# Altium schematic sheet USB_Hub.SchDoc: USB Hub
size 431 x 279 mm; Author: Eric Liu; SheetNumber: 6; SheetTotal: 6
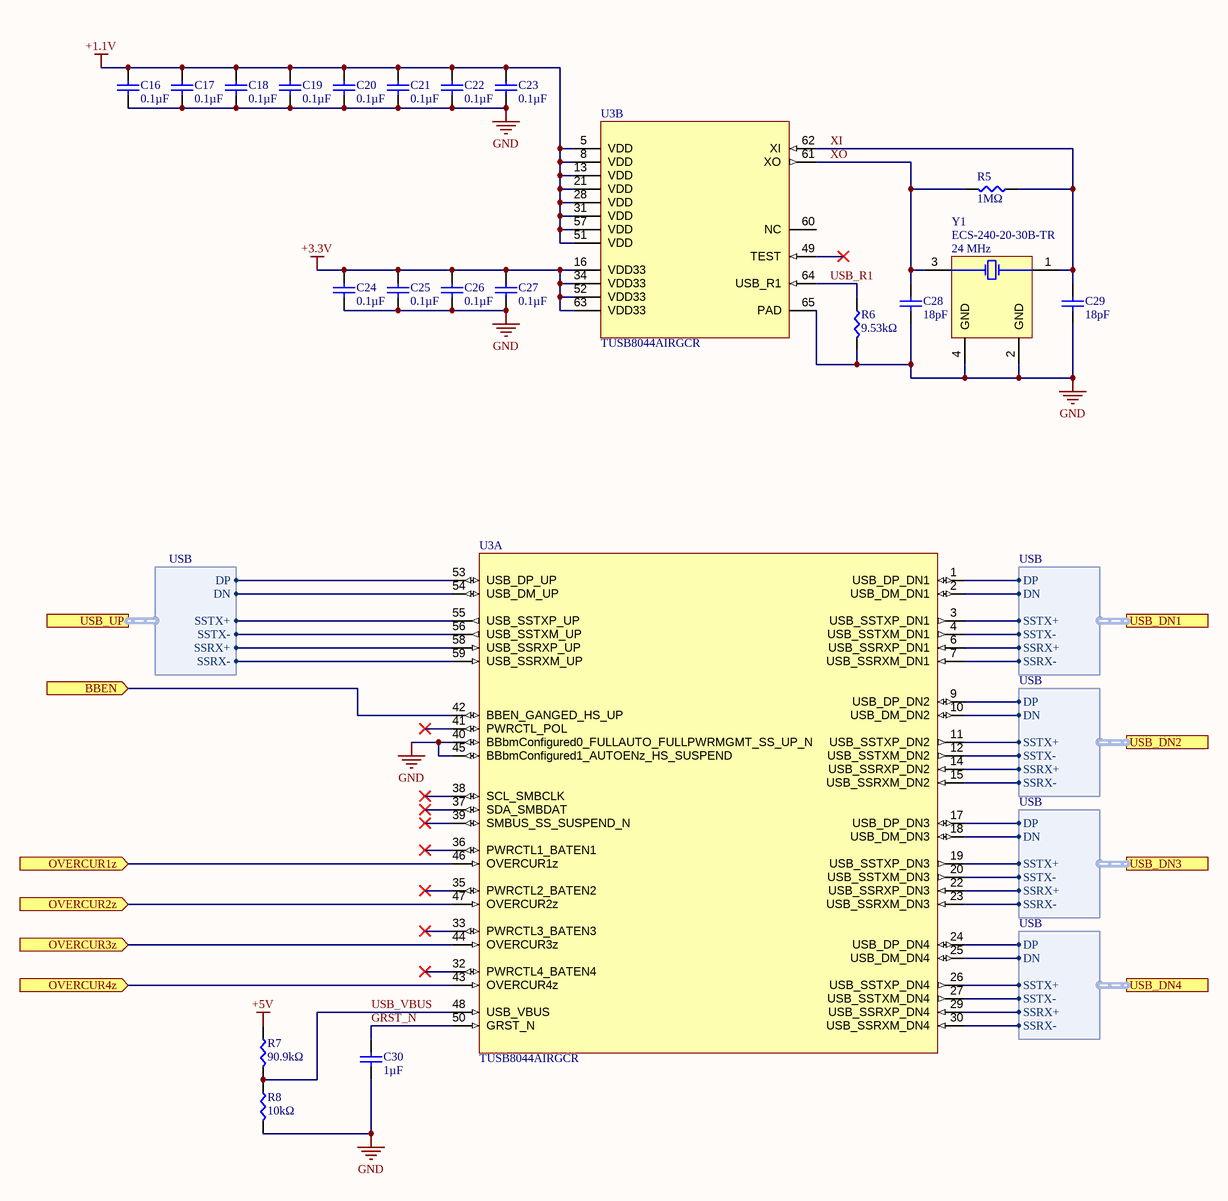
[diagram p0: USB_Hub.SchDoc]

## Parts
C16  value 0.1µF  [CAP0402]  (hidden comment: CC0402KRX5R9BB104)
C17  value 0.1µF  [CAP0402]  (hidden comment: CC0402KRX5R9BB104)
C18  value 0.1µF  [CAP0402]  (hidden comment: CC0402KRX5R9BB104)
C19  value 0.1µF  [CAP0402]  (hidden comment: CC0402KRX5R9BB104)
C20  value 0.1µF  [CAP0402]  (hidden comment: CC0402KRX5R9BB104)
C21  value 0.1µF  [CAP0402]  (hidden comment: CC0402KRX5R9BB104)
C22  value 0.1µF  [CAP0402]  (hidden comment: CC0402KRX5R9BB104)
C23  value 0.1µF  [CAP0402]  (hidden comment: CC0402KRX5R9BB104)
C24  value 0.1µF  [CAP0402]  (hidden comment: CC0402KRX5R9BB104)
C25  value 0.1µF  [CAP0402]  (hidden comment: CC0402KRX5R9BB104)
C26  value 0.1µF  [CAP0402]  (hidden comment: CC0402KRX5R9BB104)
C27  value 0.1µF  [CAP0402]  (hidden comment: CC0402KRX5R9BB104)
C28  value 18pF  [CAP0402]  (hidden comment: GJM1555C1H180FB01D)
C29  value 18pF  [CAP0402]  (hidden comment: GJM1555C1H180FB01D)
C30  value 1µF  [CAP0402]  (hidden comment: GRM155R61H105KE05D)
R5  value 1MΩ  [RES0402]  (hidden comment: RC0402FR-071ML)
R6  value 9.53kΩ  [RES0402]  (hidden comment: CRCW04029K53FKED)
R7  value 90.9kΩ  [RES0402]  (hidden comment: RC0402FR-0790K9L)
R8  value 10kΩ  [RES0402]  (hidden comment: RC0402FR-0710KL)
U3  TUSB8044AIRGCR  [RGC0064G]  (parts A,B of 2)
Y1  ECS-240-20-30B-TR  value 24 MHz  [ECS-240-20-30B-TR]

## Ports
BBEN (in), OVERCUR1z (in), OVERCUR2z (in), OVERCUR3z (in), OVERCUR4z (in), USB_DN1 (harness USB), USB_DN2 (harness USB), USB_DN3 (harness USB), USB_DN4 (harness USB), USB_UP (harness USB)

## Harnesses
USB: DP, DN, SSRX+, SSRX-, SSTX+, SSTX-

## Nets
+1.1V: C16.2 C17.2 C18.2 C19.2 C20.2 C21.2 C22.2 C23.2 U3.5(VDD) U3.8(VDD) U3.13(VDD) U3.21(VDD) U3.28(VDD) U3.31(VDD) U3.51(VDD) U3.57(VDD)
+3.3V: C24.2 C25.2 C26.2 C27.2 U3.16(VDD33) U3.34(VDD33) U3.52(VDD33) U3.63(VDD33)
+5V: R7.2
GND: C16.1 C17.1 C18.1 C19.1 C20.1 C21.1 C22.1 C23.1 C24.1 C25.1 C26.1 C27.1 C28.1 C29.1 C30.1 R6.1 R8.1 U3.40(BBbmConfigured0_FULLAUTO_FULLPWRMGMT_SS_UP_N) U3.45(BBbmConfigured1_AUTOENz_HS_SUSPEND) U3.65(PAD) Y1.2(GND) Y1.4(GND)
BBEN: U3.42(BBEN_GANGED_HS_UP) ; port BBEN
GRST_N: C30.2 U3.50(GRST_N)
OVERCUR1z: U3.46(OVERCUR1z) ; port OVERCUR1z
OVERCUR2z: U3.47(OVERCUR2z) ; port OVERCUR2z
OVERCUR3z: U3.44(OVERCUR3z) ; port OVERCUR3z
OVERCUR4z: U3.43(OVERCUR4z) ; port OVERCUR4z
USB_R1: R6.2 U3.64(USB_R1)
USB_VBUS: R7.1 R8.2 U3.48(USB_VBUS)
XI: C29.2 R5.2 U3.62(XI) Y1.1
XO: C28.2 R5.1 U3.61(XO) Y1.3
NetU3_1: U3.1(USB_DP_DN1) ; port USB_DN1.DP
NetU3_2: U3.2(USB_DM_DN1) ; port USB_DN1.DN
NetU3_3: U3.3(USB_SSTXP_DN1) ; port USB_DN1.SSTX+
NetU3_4: U3.4(USB_SSTXM_DN1) ; port USB_DN1.SSTX-
NetU3_6: U3.6(USB_SSRXP_DN1) ; port USB_DN1.SSRX+
NetU3_7: U3.7(USB_SSRXM_DN1) ; port USB_DN1.SSRX-
NetU3_9: U3.9(USB_DP_DN2) ; port USB_DN2.DP
NetU3_10: U3.10(USB_DM_DN2) ; port USB_DN2.DN
NetU3_11: U3.11(USB_SSTXP_DN2) ; port USB_DN2.SSTX+
NetU3_12: U3.12(USB_SSTXM_DN2) ; port USB_DN2.SSTX-
NetU3_14: U3.14(USB_SSRXP_DN2) ; port USB_DN2.SSRX+
NetU3_15: U3.15(USB_SSRXM_DN2) ; port USB_DN2.SSRX-
NetU3_17: U3.17(USB_DP_DN3) ; port USB_DN3.DP
NetU3_18: U3.18(USB_DM_DN3) ; port USB_DN3.DN
NetU3_19: U3.19(USB_SSTXP_DN3) ; port USB_DN3.SSTX+
NetU3_20: U3.20(USB_SSTXM_DN3) ; port USB_DN3.SSTX-
NetU3_22: U3.22(USB_SSRXP_DN3) ; port USB_DN3.SSRX+
NetU3_23: U3.23(USB_SSRXM_DN3) ; port USB_DN3.SSRX-
NetU3_24: U3.24(USB_DP_DN4) ; port USB_DN4.DP
NetU3_25: U3.25(USB_DM_DN4) ; port USB_DN4.DN
NetU3_26: U3.26(USB_SSTXP_DN4) ; port USB_DN4.SSTX+
NetU3_27: U3.27(USB_SSTXM_DN4) ; port USB_DN4.SSTX-
NetU3_29: U3.29(USB_SSRXP_DN4) ; port USB_DN4.SSRX+
NetU3_30: U3.30(USB_SSRXM_DN4) ; port USB_DN4.SSRX-
NetU3_53: U3.53(USB_DP_UP) ; port USB_UP.DP
NetU3_54: U3.54(USB_DM_UP) ; port USB_UP.DN
NetU3_55: U3.55(USB_SSTXP_UP) ; port USB_UP.SSTX+
NetU3_56: U3.56(USB_SSTXM_UP) ; port USB_UP.SSTX-
NetU3_58: U3.58(USB_SSRXP_UP) ; port USB_UP.SSRX+
NetU3_59: U3.59(USB_SSRXM_UP) ; port USB_UP.SSRX-

Not connected (* = marked no-connect by the designer): U3 32(PWRCTL4_BATEN4)* 33(PWRCTL3_BATEN3)* 35(PWRCTL2_BATEN2)* 36(PWRCTL1_BATEN1)* 37(SDA_SMBDAT)* 38(SCL_SMBCLK)* 39(SMBUS_SS_SUSPEND_N)* 41(PWRCTL_POL)* 49(TEST)* 60(NC)

## Notes on the sheet
- DWG. NO.
- REV.
- SHT.
- THIS DOCUMENT AND THE DATA DISCLOSED HEREIN OR HEREWITH IS THE PROPERTY OF ALTIUM LIMITED AND MAY BE FREELY DISTRIBUTED IN WHOLE. NO RIGHTS ARE RESERVED OR EXPRESS OR IMPLIED WARANTEE GIVEN.
- REVISION
- DESCRIPTION
- DATE
- APPROVED
- ENG:
- APPROVALS
- PROJECT
- DSN:
- CHK:
- REFERENCE DOCUMENTS
- PROJECT REVISION:
- TITLE
- DOCUMENT REVISION:
- DESIGN ITEM:
- BOM:
- FAB DWG:
- PCB DWG:
- ASSY DWG:
- SCALE:
- SIZE
- B
- CAGE CODE
- FILE NAME
- DWG NO.
- SHEET
- OF
- REV

## Library data of the parts
C16-C27 = CC0402KRX5R9BB104: 0.1 µF ±10% 50V Ceramic Capacitor X5R 0402 (1005 Metric); Temperature Coefficient: X5R; Package: 0402 (1005 Metric); Voltage: 50V
C28 C29 = GJM1555C1H180FB01D: 18 pF ±1% 50V Ceramic Capacitor C0G, NP0 0402 (1005 Metric); Temperature Coefficient: C0G, NP0; Package: 0402 (1005 Metric); Voltage: 50V
C30 = GRM155R61H105KE05D: 1 µF ±10% 50V Ceramic Capacitor X5R 0402 (1005 Metric); Temperature Coefficient: X5R; Package: 0402 (1005 Metric); Voltage: 50V
R5 = RC0402FR-071ML: 1 MOhms ±1% 0.063W, 1/16W Chip Resistor 0402 (1005 Metric) Moisture Resistant Thick Film; Manufacturer 1: YAGEO; Manufacturer Part Number 1: RC0402FR-071ML; Supplier Part Number 1: 311-1.00MLRCT-ND; Supplier 1: Digi-Key; Power Rating: 1/16W
R6 = CRCW04029K53FKED: 9.53 kOhms ±1% 0.1W, 1/10W Chip Resistor 0402 (1005 Metric) Automotive AEC-Q200 Thick Film; Manufacturer 1: Vishay Dale; Manufacturer Part Number 1: CRCW04029K53FKED; Supplier Part Number 1: 541-9.53KLCT-ND; Supplier 1: Digi-Key; Power Rating: 1/10W
R7 = RC0402FR-0790K9L: 90.9 kOhms ±1% 0.063W, 1/16W Chip Resistor 0402 (1005 Metric) Moisture Resistant Thick Film; Manufacturer 1: YAGEO; Manufacturer Part Number 1: RC0402FR-0751KL; Supplier Part Number 1: 311-51.0KLRCT-ND; Supplier 1: Digi-Key; Power Rating: 1/16W
R8 = RC0402FR-0710KL: 10 kOhms ±1% 0.063W, 1/16W Chip Resistor 0402 (1005 Metric) Moisture Resistant Thick Film; Manufacturer 1: YAGEO; Manufacturer Part Number 1: RC0402FR-0710KL; Supplier Part Number 1: 311-10.0KLRCT-ND; Supplier 1: Digi-Key; Power Rating: 1/16W
U3 = TUSB8044AIRGCR: Four-port USB 3.2 x1 Gen1 hub with USB billboard 64-VQFN -40 to 85; Manufacturer_Name: Texas Instruments; TYPE: TYPE; RefDes: RefDes; Copyright: Copyright (C) 2026 Ultra Librarian. All rights reserved.; Manufacturer_Part_Number: TUSB8044AIRGCR; Datasheet: https://www.ti.com/lit/gpn/tusb8044a
Y1 = ECS-240-20-30B-TR: 24 MHz ±30ppm Crystal 20pF 30 Ohms 4-SMD, No Lead; Manufacturer 1: ECS Inc.; ESR (Equivalent Series Resistance): 30Ω; Manufacturer Part Number 1: ECS-240-20-30B-TR; Supplier Part Number 1: XC1122CT-ND; Supplier 1: Digi-Key; Load Capacitance: 20pF